# EAGLE schematic Actor_6_Channel_PM (EAGLE 6.1)
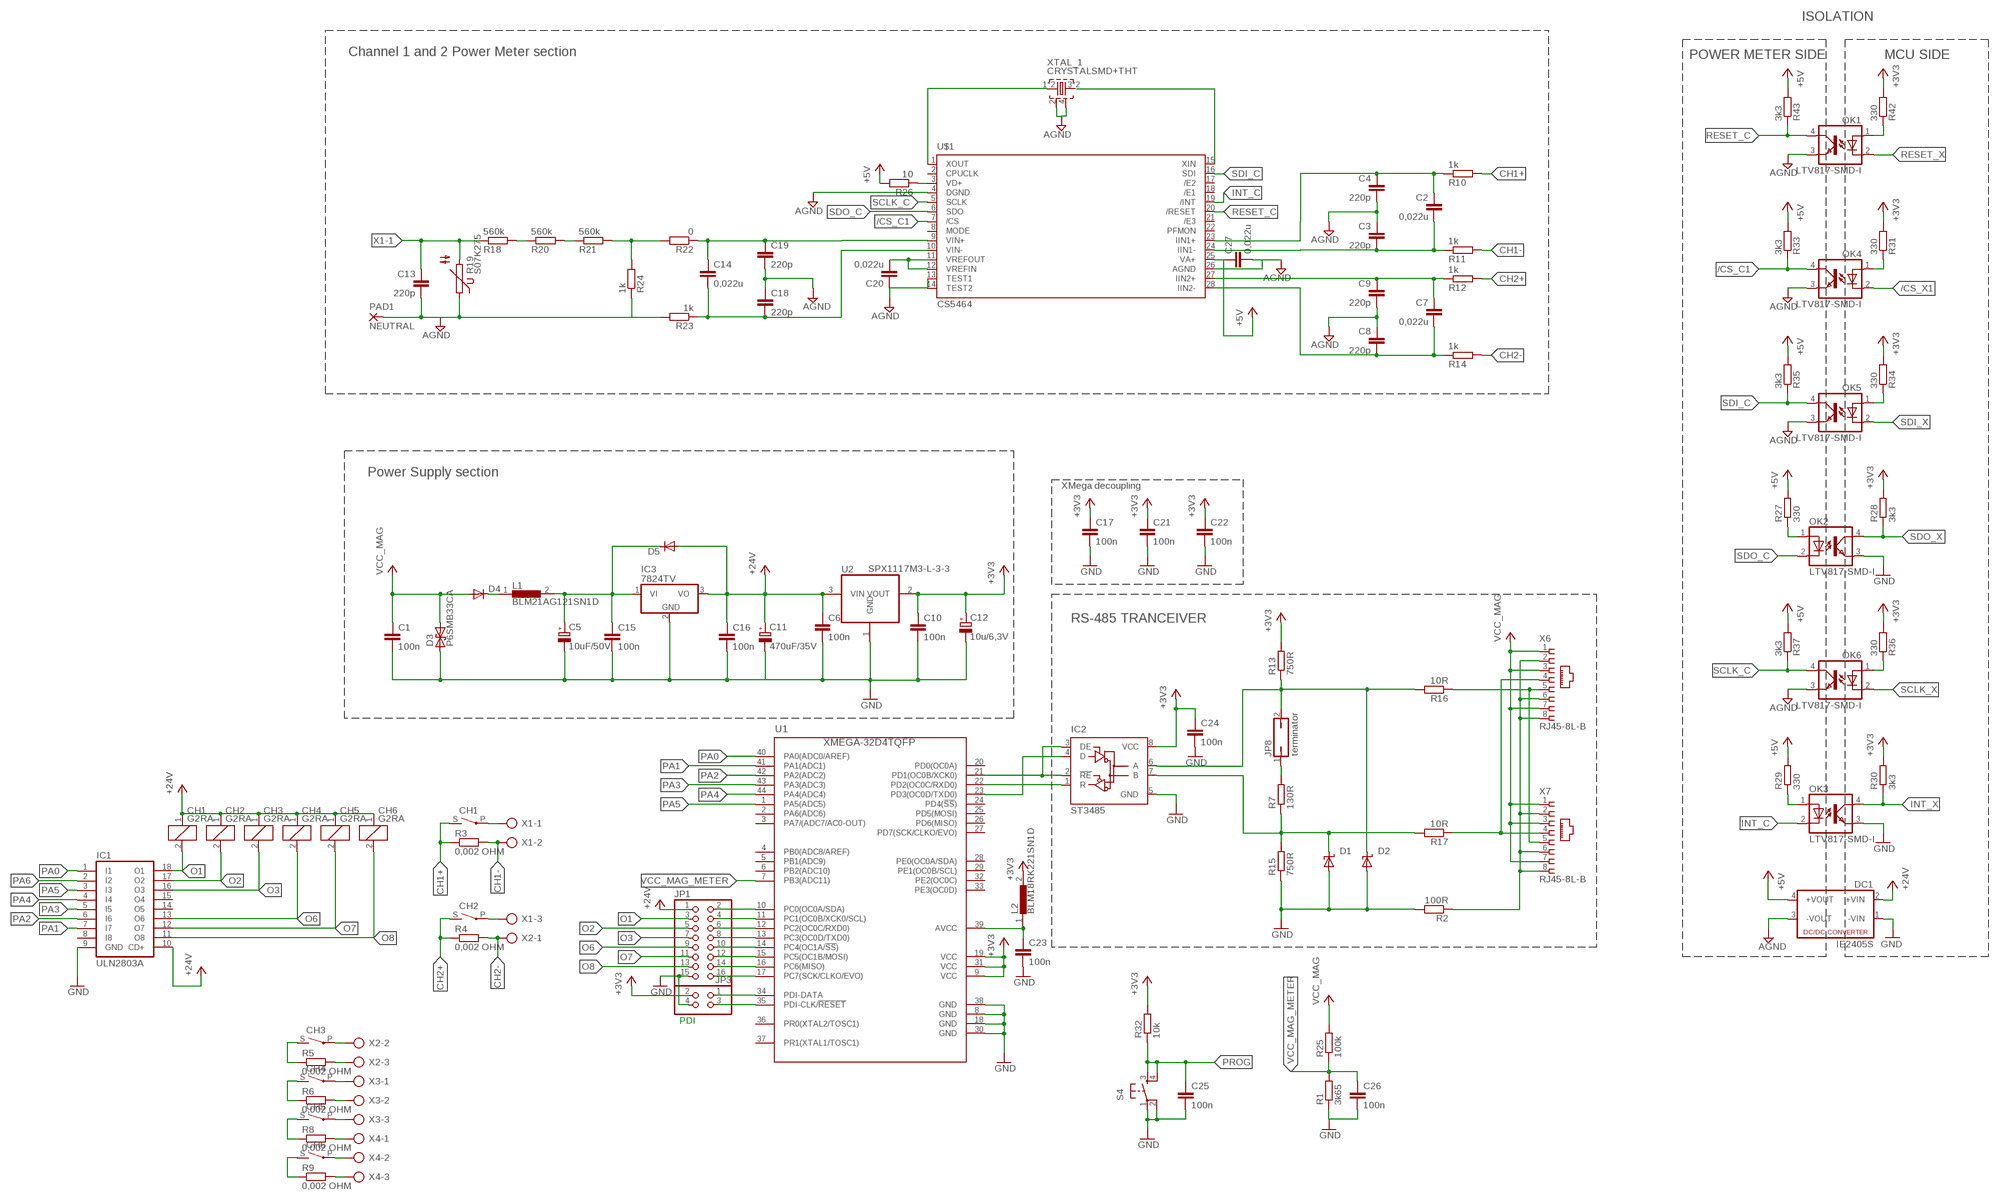
[diagram p0: schematic, sheet 1]

## Parts
C1  100n  C-EUC0603K  [C0603K]
C2  0,022u  C-EUC0603K  [C0603K]
C3  220p  C-EUC0603K  [C0603K]
C4  220p  C-EUC0603K  [C0603K]
C5  10uF/50V  CPOL-EUE2.5-5  [E2,5-5]
C6  100n  C-EUC0603K  [C0603K]
C7  0,022u  C-EUC0603K  [C0603K]
C8  220p  C-EUC0603K  [C0603K]
C9  220p  C-EUC0603K  [C0603K]
C10  100n  C-EUC0603K  [C0603K]
C11  470uF/35V  CPOL-EUE5-10.5  [E5-10,5]
C12  10u/6,3V  CPOL-EUE2-4  [E2-4]
C13  220p  C-EUC0603K  [C0603K]
C14  0,022u  C-EUC0603K  [C0603K]
C15  100n  C-EUC0603K  [C0603K]
C16  100n  C-EUC0603K  [C0603K]
C17  100n  C-EUC0603K  [C0603K]
C18  220p  C-EUC0603K  [C0603K]
C19  220p  C-EUC0603K  [C0603K]
C20  0,022u  C-EUC0603K  [C0603K]
C21  100n  C-EUC0603K  [C0603K]
C22  100n  C-EUC0603K  [C0603K]
C23  100n  C-EUC0603K  [C0603K]
C24  100n  C-EUC0603K  [C0603K]
C25  100n  C-EUC0603  [C0603]
C26  100n  C-EUC0603  [C0603]
C27  0,022u  C-EUC0603K  [C0603K]
CH1  G2RA  [G2RA]
CH2  G2RA  [G2RA]
CH3  G2RA  [G2RA]
CH4  G2RA  [G2RA]
CH5  G2RA  [G2RA]
CH6  G2RA  [G2RA]
D1  SUPPRESSOR-SMBJ  [SMBJ]
D2  SUPPRESSOR-SMBJ  [SMBJ]
D3  P6SMB33CA  P6KEXXCSMD  [DO214AA]
D4  DIODE-DO214AA  [DO214AA]
D5  DIODE-DO214AA  [DO214AA]
DC1  IE2405S  VA-0524S  [4SIL]
IC1  ULN2803A  ULN2803ASMD_SO18  [SO18W]
IC2  ST3485  75176AD  [D_R-PDSO-G8]
IC3  7824TV  [TO220V]
JP1  PINHD-2X8  [2X08]
JP3  PINHD-2X2  [2X02]
JP8  terminator  JP1Q  [JP1]
L1  BLM21AG121SN1D  [805]
L2  BLM18RK221SN1D  [0603]
OK1  LTV817-SMD-I  LTV816S  [SMD4]
OK2  LTV817-SMD-I  LTV816S  [SMD4]
OK3  LTV817-SMD-I  LTV816S  [SMD4]
OK4  LTV817-SMD-I  LTV816S  [SMD4]
OK5  LTV817-SMD-I  LTV816S  [SMD4]
OK6  LTV817-SMD-I  LTV816S  [SMD4]
PAD1  NEUTRAL  2,54/1,0  [2,54/1,0]
R1  3k65  R-EU_R0603  [R0603]
R2  100R  R-EU_R0603  [R0603]
R3  0,002 OHM  R-EU_R2512  [R2512]
R4  0,002 OHM  R-EU_R2512  [R2512]
R5  0,002 OHM  R-EU_R2512  [R2512]
R6  0,002 OHM  R-EU_R2512  [R2512]
R7  130R  R-EU_R0603  [R0603]
R8  0,002 OHM  R-EU_R2512  [R2512]
R9  0,002 OHM  R-EU_R2512  [R2512]
R10  1k  R-EU_R0603  [R0603]
R11  1k  R-EU_R0603  [R0603]
R12  1k  R-EU_R0603  [R0603]
R13  750R  R-EU_R0603  [R0603]
R14  1k  R-EU_R0603  [R0603]
R15  750R  R-EU_M1206  [M1206]
R16  10R  R-EU_R0603  [R0603]
R17  10R  R-EU_R0603  [R0603]
R18  560k  R-EU_R0603  [R0603]
R19  S07K275  [S07K275]
R20  560k  R-EU_R0603  [R0603]
R21  560k  R-EU_R0603  [R0603]
R22  0  R-EU_R0603  [R0603]
R23  1k  R-EU_R0603  [R0603]
R24  1k  R-EU_R0603  [R0603]
R25  100k  R-EU_R0603  [R0603]
R26  10  R-EU_R0603  [R0603]
R27  330  R-EU_M0805  [M0805]
R28  3k3  R-EU_M0805  [M0805]
R29  330  R-EU_M0805  [M0805]
R30  3k3  R-EU_M0805  [M0805]
R31  330  R-EU_M0805  [M0805]
R32  10k  R-EU_R0603  [R0603]
R33  3k3  R-EU_M0805  [M0805]
R34  330  R-EU_M0805  [M0805]
R35  3k3  R-EU_M0805  [M0805]
R36  330  R-EU_M0805  [M0805]
R37  3k3  R-EU_M0805  [M0805]
R42  330  R-EU_M0805  [M0805]
R43  3k3  R-EU_M0805  [M0805]
S4  SPARKFUN_TAC_SWITCHPTH  [SPARKFUN_TACTILE-PTH]
U1  XMEGA-32D4TQFP  XMEGA-D4TQFP  [TQFP44]
U2  SPX1117M3-L-3-3  REG1117  [SOT223]
U$1  CS5464  [SSOP-28L]
X1  MKDS_5/3-7,5  [MKDS_5/-750]
X2  MKDS_5/3-7,5  [MKDS_5/-750]
X3  MKDS_5/3-7,5  [MKDS_5/-750]
X4  MKDS_5/3-7,5  [MKDS_5/-750]
X6  RJ45-8L-B  [RJ45-NO-SHIELD]
X7  RJ45-8L-B  [RJ45-NO-SHIELD]
XTAL_1  CRYSTALSMD+THT  [CRYSTAL20H+MT38]

## Nets
+3V3: C10.1 C12.+ C17.1 C21.1 C22.1 C24.1 IC2.8(VCC) JP3.2 L2.2 R13.2 R28.2 R30.2 R31.2 R32.2 R34.2 R36.2 R42.2 U1.9(VCC) U1.19(VCC) U1.31(VCC) U2.2(VOUT)
+5V: C27.1 DC1.4(+VOUT) R26.2 R27.2 R29.2 R33.2 R35.2 R37.2 R43.2 U$1.25(VA+)
+24V: C6.1 C11.+ C16.1 CH1.1 CH2.1 CH3.1 CH4.1 CH5.1 CH6.1 D5.A IC1.10(CD+) IC3.3(VO) U2.3(VIN)
/CS_C1: OK4.4(COL) R33.1 U$1.7(/CS)
/CS_X1: OK4.2(C)
A: R16.1 X6.5 X7.5
AGND: C3.1 C4.2 C8.1 C9.2 C13.2 C18.1 C19.2 C20.1 C27.2 DC1.3(-VOUT) OK1.3(EMIT) OK4.3(EMIT) OK5.3(EMIT) OK6.3(EMIT) PAD1.1(P) R19.1 R23.2 R24.1 U$1.4(DGND) U$1.13(TEST1) U$1.14(TEST2) U$1.26(AGND) XTAL_1.2 XTAL_1.4
B: R17.1 X6.4 X7.4
CH1+: CH1.S(2:S) R3.1 R10.2
CH1-: R3.2 R11.2 X1.2
CH2+: CH2.S(2:S) R4.1 R12.2
CH2-: R4.2 R14.2 X2.1
GND: C1.2 C5.- C6.2 C10.2 C11.- C12.- C15.2 C16.2 C17.2 C21.2 C22.2 C23.2 C24.2 C25.2 C26.2 D1.A D2.A D3.A DC1.1(-VIN) IC1.9(GND) IC2.5(GND) IC3.2(GND) JP1.15 JP3.4 OK2.3(EMIT) OK3.3(EMIT) R1.1 R2.2 R15.1 S4.1 S4.2 U1.8(GND) U1.18(GND) U1.30(GND) U1.38(GND) U2.1(GND)
GND_RS485: R2.1 X6.2 X6.6 X6.8 X7.2 X7.6 X7.8
INT_C: OK3.2(C) U$1.19(/INT)
INT_X: OK3.4(COL) R30.1
N$1: R18.2 R20.1
N$2: C7.2 C8.2 R14.1 U$1.28(IIN2-)
N$3: CH2.P(2:P) X1.3
N$4: C2.2 C3.2 R11.1 U$1.24(IIN1-)
N$5: CH3.P(2:P) X2.2
N$6: C2.1 C4.1 R10.1 U$1.23(IIN1+)
N$7: R26.1 U$1.3(VD+)
N$8: C20.2 U$1.11(VREFOUT) U$1.12(VREFIN)
N$9: OK1.1(A) R42.1
N$10: OK2.1(A) R27.1
N$11: OK3.1(A) R29.1
N$12: OK4.1(A) R31.1
N$13: CH4.P(2:P) X3.1
N$14: C5.+ C15.1 D5.C IC3.1(VI) L1.2
N$15: JP8.1 R7.2
N$16: D1.C IC2.7(B) R7.1 R15.2 R17.2
N$17: D4.C L1.1
N$18: C7.1 C9.1 R12.1 U$1.27(IIN2+)
N$19: CH5.P(2:P) X3.3
N$20: CH3.S(2:S) R5.1
N$21: CH6.P(2:P) X4.2
N$22: R5.2 X2.3
N$23: CH4.S(2:S) R6.1
N$24: IC2.2(!RE) IC2.3(DE) U1.21(PD1(OC0B/XCK0))
N$25: IC2.4(D) U1.23(PD3(OC0D/TXD0))
N$26: IC2.1(R) U1.22(PD2(OC0C/RXD0))
N$27: R6.2 X3.2
N$28: CH5.S(2:S) R8.1
N$29: R8.2 X4.1
N$30: CH6.S(2:S) R9.1
N$31: R9.2 X4.3
N$32: U$1.1(XOUT) XTAL_1.1 XTAL_1.1_T
N$33: U$1.15(XIN)
N$34: R20.2 R21.1
N$35: C14.2 C18.2 R23.1 U$1.10(VIN-)
N$36: C14.1 C19.1 R22.1 U$1.9(VIN+)
N$37: OK5.1(A) R34.1
N$38: R21.2 R22.2 R24.2
N$39: OK6.1(A) R36.1
N$46: JP1.16 U1.17(PC7(SCK/CLKO/EVO))
N$47: JP1.14 U1.16(PC6(MISO))
N$48: JP1.12 U1.15(PC5(OC1B/MOSI))
N$49: JP1.10 U1.14(PC4(OC1A/!SS!))
N$50: JP1.8 U1.13(PC3(OC0D/TXD0))
N$51: JP1.6 U1.12(PC2(OC0C/RXD0))
N$52: JP1.4 U1.11(PC1(OC0B/XCK0/SCL))
N$53: JP1.2 U1.10(PC0(OC0A/SDA))
N$54: JP3.1 U1.34(PDI-DATA)
N$55: JP3.3 U1.35(PDI-CLK/!RESET)
N$56: C23.1 L2.1 U1.39(AVCC)
O1: CH1.2 IC1.18(O1) JP1.3
O2: CH2.2 IC1.17(O2) JP1.5
O3: CH3.2 IC1.16(O3) JP1.7
O6: CH4.2 IC1.13(O6) JP1.9
O7: CH5.2 IC1.12(O7) JP1.11
O8: CH6.2 IC1.11(O8) JP1.13
PA0: IC1.1(I1) U1.40(PA0(ADC0/AREF))
PA1: IC1.7(I7) U1.41(PA1(ADC1))
PA2: IC1.6(I6) U1.42(PA2(ADC2))
PA3: IC1.5(I5) U1.43(PA3(ADC3))
PA4: IC1.4(I4) U1.44(PA4(ADC4))
PA5: IC1.3(I3) U1.1(PA5(ADC5))
PA6: IC1.2(I2)
PROG: C25.1 R32.1 S4.3 S4.4
RESET_C: OK1.4(COL) R43.1 U$1.20(/RESET)
RESET_X: OK1.2(C)
RS485_A1: D2.C IC2.6(A) JP8.2 R13.1 R16.2
SCLK_C: OK6.4(COL) R37.1 U$1.5(SCLK)
SCLK_X: OK6.2(C)
SDI_C: OK5.4(COL) R35.1 U$1.16(SDI)
SDI_X: OK5.2(C)
SDO_C: OK2.2(C) U$1.6(SDO)
SDO_X: OK2.4(COL) R28.1
VCC: C1.1 D3.C D4.A DC1.2(+VIN) JP1.1 ; supply symbol labelled VCC_MAG, +24V
VCC_MAG: R25.2 X6.1 X6.3 X6.7 X7.1 X7.3 X7.7
VCC_MAG_METER: C26.1 R1.2 R25.1 U1.7(PB3(ADC11))
X1-1: C13.1 CH1.P(2:P) R18.1 R19.2 X1.1
Unconnected: IC1.8(I8) IC1.14(O5) IC1.15(O4) U1.2(PA6(ADC6)) U1.3(PA7/(ADC7/AC0-OUT)) U1.4(PB0(ADC8/AREF)) U1.5(PB1(ADC9)) U1.6(PB2(ADC10)) U1.20(PD0(OC0A)) U1.24(PD4(!SS!)) U1.25(PD5(MOSI)) U1.26(PD6(MISO)) U1.27(PD7(SCK/CLKO/EVO)) U1.28(PE0(OC0A/SDA)) U1.29(PE1(OC0B/SCL)) U1.32(PE2(OC0C)) U1.33(PE3(OC0D)) U1.36(PR0(XTAL2/TOSC1)) U1.37(PR1(XTAL1/TOSC1)) U$1.2(CPUCLK) U$1.17(/E2) U$1.18(/E1) U$1.21(/E3) U$1.22(PFMON) XTAL_1.3 XTAL_1.3T

## Notes on the sheet
- ISOLATION
- POWER METER SIDE | MCU SIDE
- Channel 1 and 2 Power Meter section
- Power Supply section
- XMega decoupling
- RS-485 TRANCEIVER
- PDI

## Power pins joined to a net without a drawn wire
MODE: U$1.8(MODE)

## Library data of the parts
C1-C4 C6-C10 C13-C27 = rcl:C-EU: CAPACITOR, European symbol
C5 C11 C12 = rcl:CPOL-EU: POLARIZED CAPACITOR, European symbol
CH1-CH6 = relay:G2RA: RELAY 1 x norm. open, Omron; OC_FARNELL: unknown; OC_NEWARK: unknown
D1 D2 = diode:SUPPRESSOR-: Suppressor diode
D3 = diode:P6KEXXC: DIODE transient-voltage suppressor
D4 D5 = diode:DIODE-: DIODE
DC1 = dc-dc-converter:VA-*?: DC DC Converter Single Output, 1 Watt Motien Technology Co.,Ltd. Source: va-serie.pdf; OC_FARNELL: unknown; OC_NEWARK: unknown
IC1 = uln-udn:ULN2803A: DRIVER ARRAY
IC2 = 751xx:75176A: DIFFERENTIAL BUS TRANSCEIVER Source: http://focus.ti.com/lit/ds/symlink/sn75176a.pdf
IC3 = linear:78*: Positive VOLTAGE REGULATOR Source: http://cache.national.com/ds/LM/LM78L05.pdf http://www.fairchildsemi.com/ds/LM/LM7805.pdf
JP1 = pinhead:PINHD-2X8: PIN HEADER
JP3 = pinhead:PINHD-2X2: PIN HEADER
JP8 = jumper:JP1Q: JUMPER
L1 = inductors:BLM21AG121SN1D
L2 = inductors:BLM18RK221SN1D
OK1-OK6 = optocoupler:LTV816: OPTO COUPLER Source: LITEON, LTV816.pdf; OC_FARNELL: unknown; OC_NEWARK: unknown
PAD1 = wirepad:2,54/1,0: THROUGH-HOLE PAD
R1 R2 R7 R10-R18 R20-R37 R42 R43 = rcl:R-EU_: RESISTOR, European symbol
R3-R6 R8 R9 = resistor:R-EU_: RESISTOR, European symbol
R19 = varistor:S07K275: VARISTOR
S4 = Nokia-Breakout-v14:SPARKFUN_TAC_SWITCH: Momentary Switch Button commonly used for reset or general input. Spark Fun Electronics SKU : COM-00097
U1 = avr-7:XMEGA-D4: Atmel AVR XMega D4 series processor
U2 = burr-brown:REG1117: 800mA and 1A Low Dropout (LDO) Positive Regulator 1.8V, 2.5V, 2.85V, 3.3V, 5V, and Adj; MPN: REG1117; OC_FARNELL: 1097566; OC_NEWARK: 14P6981
U$1 = myHome:CS5464
X1-X4 = con-phoenix-mkds_5:MKDS_5/3-: MKDS 5/3-6,35 Source: PHOENIX CONTACT
X6 X7 = con-tycoelectronics:RJ45: CORCOM Modular RJ Jacks No Shield Source: www.tycoelectronics.com .. ENG_DS_1654001_1099_RJ_L_0507.pdf; MF: TYCO ELECTRONICS; MPN: RJ45-8L-B; OC_FARNELL: 1279843; OC_NEWARK: 52K4445
XTAL_1 = myHome:CRYSTALSMD+THT